# EAGLE design switch (EAGLE 7.7.0)
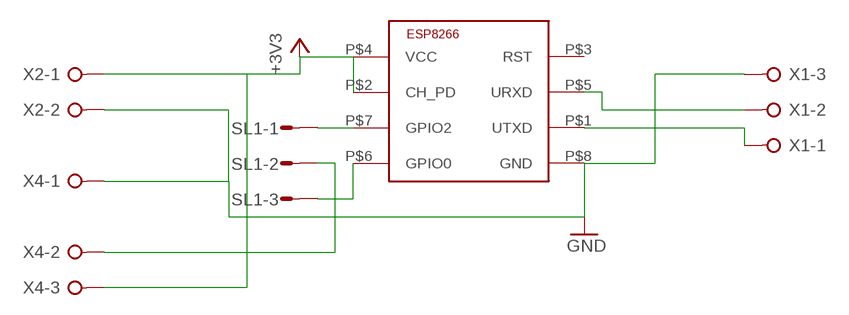
[diagram p0: schematic, sheet 1]

## Parts
SL1  M03S  [03P]
U$1  ESP8266-01  [ESP-01]
X1  W237-3E  [W237-3E]
X2  W237-02P  [W237-132]
X4  W237-3E  [W237-3E]

## Nets
+3V3: U$1.P$2(CH_PD) U$1.P$4(VCC) X2.1 X4.3
GND: U$1.P$8(GND) X1.3 X2.2 X4.1
GPIO0: SL1.3 U$1.P$6(GPIO0)
GPIO2: SL1.1 U$1.P$7(GPIO2)
N$1: U$1.P$5(URXD) X1.2
N$2: SL1.2 X4.2
N$3: U$1.P$1(UTXD) X1.1
Unconnected: U$1.P$3(RST)

## Library data of the parts
SL1 = con-amp-quick:M03S: AMP QUICK CONNECTOR; OC_FARNELL: unknown; OC_NEWARK: unknown
U$1 = ESP8266:ESP8266-01: ESP8266 - ESP-01 Module
X1 X4 = con-wago-508:W237-3E: WAGO SREW CLAMP; OC_FARNELL: unknown; OC_NEWARK: unknown
X2 = con-wago-508:W237-02P: WAGO SREW CLAMP; OC_FARNELL: unknown; OC_NEWARK: unknown

## Board
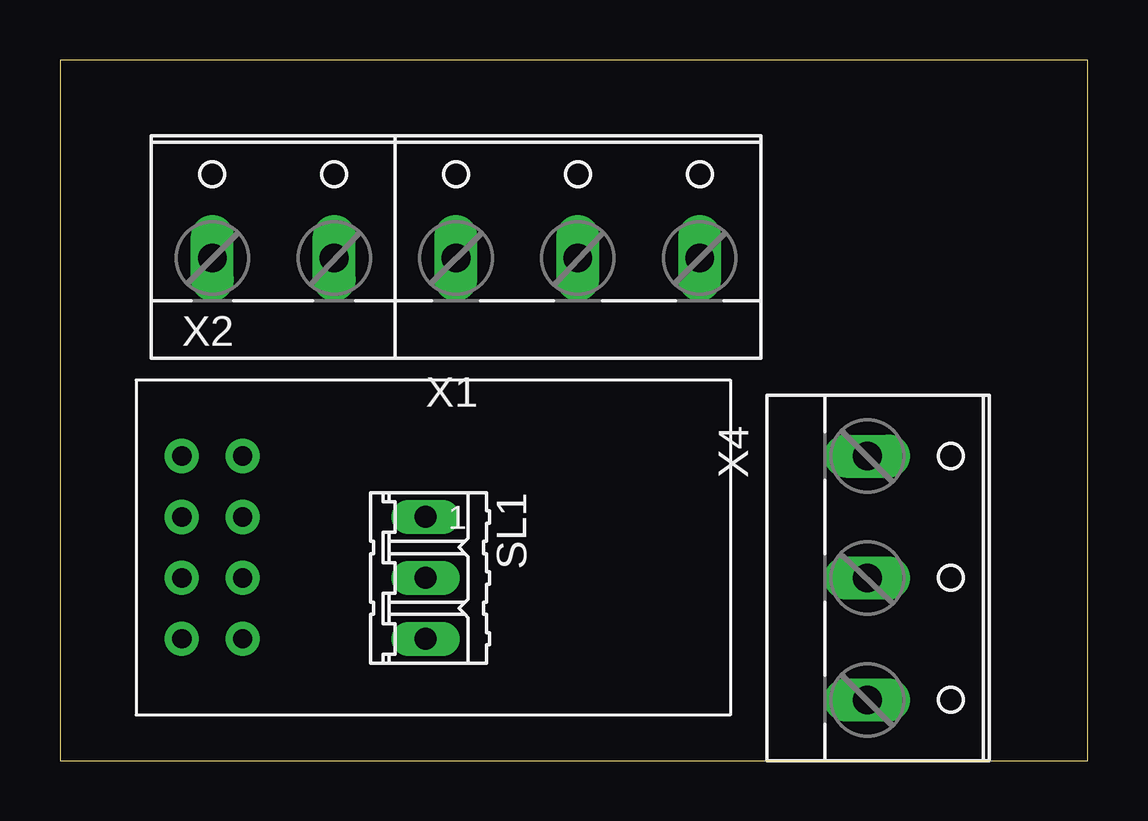
[diagram p1: board, top side]
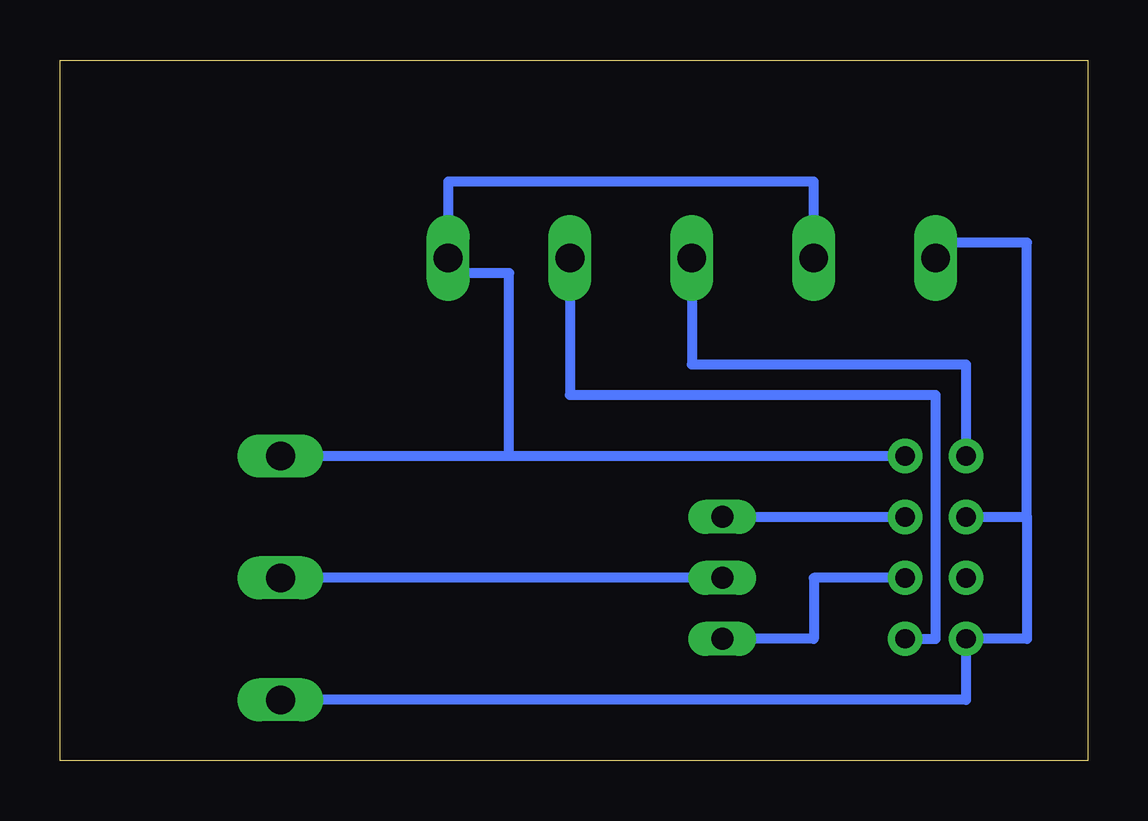
[diagram p2: board, bottom side, seen from below]

Size 42.85 x 29.2 mm. Coordinates in mm from the lower left corner, seen from the top.
Outline: 0,0 42.85,0 42.85,29.2 0,29.2 0,0
Copper layers (1*16): Top 0.035mm / dielectric 1.5mm / Bottom 0.035mm
Design rules "default": minimum track width 10mil, minimum drill 24mil, track to track 8mil, track to pad 8mil, pad to pad 8mil, via to via 8mil, smd to smd 8mil, copper to edge 40mil, drill to drill 8mil, minimum pad ring 10mil, minimum via ring 8mil, stop-mask expansion 4mil, vias tented up to drill 0mil, thermal gap 10mil

### Footprints (pad centres in the part's own frame; a part is rotated, then mirrored left to right if it is on the bottom)
03P = drill 0.914 long: 1 -2.54,0; 2 0,0; 3 2.54,0
ESP-01 = drill 0.8 pad 1.422: P$1 0,0; P$2 2.54,0; P$3 5.08,0; P$4 7.62,0; P$5 7.62,2.54; P$6 5.08,2.54; P$7 2.54,2.54; P$8 0,2.54
W237-3E = drill 1.194 long: 1 -5.08,-0.635; 2 0,-0.635; 3 5.08,-0.635
W237-132 = drill 1.194 long: 1 -2.54,-0.635; 2 2.54,-0.635

### Placement (x,y rotation side)
SL1  15.24,7.62 270 top
U$1  5.08,12.7 270 top
X1  21.59,21.59 0 top
X2  8.89,21.59 0 top
X4  34.29,7.62 270 top

### Tracks (layer width: path | path; a pad name or v marks a point on that pad's centre or on a via)
+3V3
  Bottom 0.406: 2.54,10.16 2.54,5.08 U$1.P$4 5.08,2.54 X4.3 | U$1.P$2 2.54,10.16 | 2.54,10.16 2.54,21.59 6.35,21.59 X2.1
GND
  Bottom 0.406: U$1.P$8 24.13,12.7 | 24.13,12.7 24.13,20.32 26.67,20.32 X1.3 26.67,24.13 11.43,24.13 X2.2 | 24.13,12.7 X4.1
GPIO0
  Bottom 0.406: U$1.P$6 11.43,7.62 11.43,5.08 SL1.3
GPIO2
  Bottom 0.406: SL1.1 U$1.P$7
N$1
  Bottom 0.406: U$1.P$5 6.35,5.08 6.35,15.24 21.59,15.24 X1.2
N$2
  Bottom 0.406: SL1.2 X4.2
N$3
  Bottom 0.406: U$1.P$1 5.08,16.51 16.51,16.51 X1.1